# Altium schematic sheet Main.SchDoc
size 279 x 215 mm; SheetNumber: 1; SheetTotal: 4
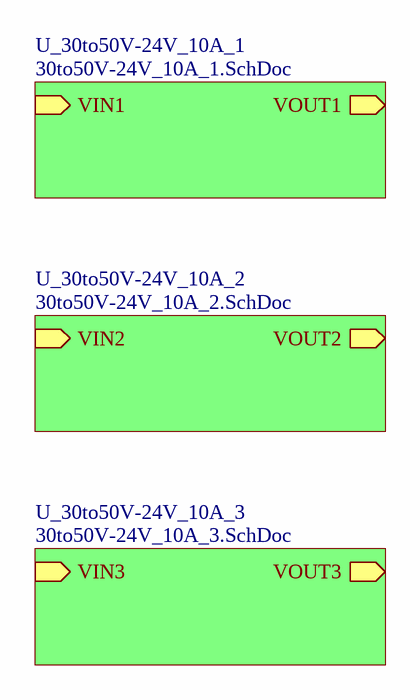
[diagram p0: Main.SchDoc]

## Sub-sheets
U_30to50V-24V_10A_1 = 30to50V-24V_10A_1.SchDoc: VIN1 (in), VOUT1 (out)
U_30to50V-24V_10A_2 = 30to50V-24V_10A_2.SchDoc: VIN2 (in), VOUT2 (out)
U_30to50V-24V_10A_3 = 30to50V-24V_10A_3.SchDoc: VIN3 (in), VOUT3 (out)

## Notes on the sheet
- University of Waterloo Robotics Team
- 200 University Ave W
- REV
- PROJECT
- Waterloo, Ontario, Canada
- N2L 3G1
- DOCUMENT
- ENGINEER
- REVIEWER
- MODIFIED
- SHEET
- OF